# Altium schematic sheet Driver.SchDoc
size 304 x 495 mm; SheetNumber: 1; SheetTotal: 4; SPICEModelCacheATHDNDMS: <root> / <DocumentId>ATHDNDMS</DocumentId> / <CacheFrame Number="0"> / <Model Name="1210_885012009019_2.2nf" Kind="CKT"> / <Text>******* / .subckt 1210_885012009019_2.2nF 1 2 / Rser 1 3 0.0215418747712 / Lser 2 4 2.06777607E-10 / C1 3 4 0.0000000022 / Rpar 3 4 10000000000 / .ends 1210_885012009019_2.2nF</Text> / </Model> / </CacheFrame> / </root>
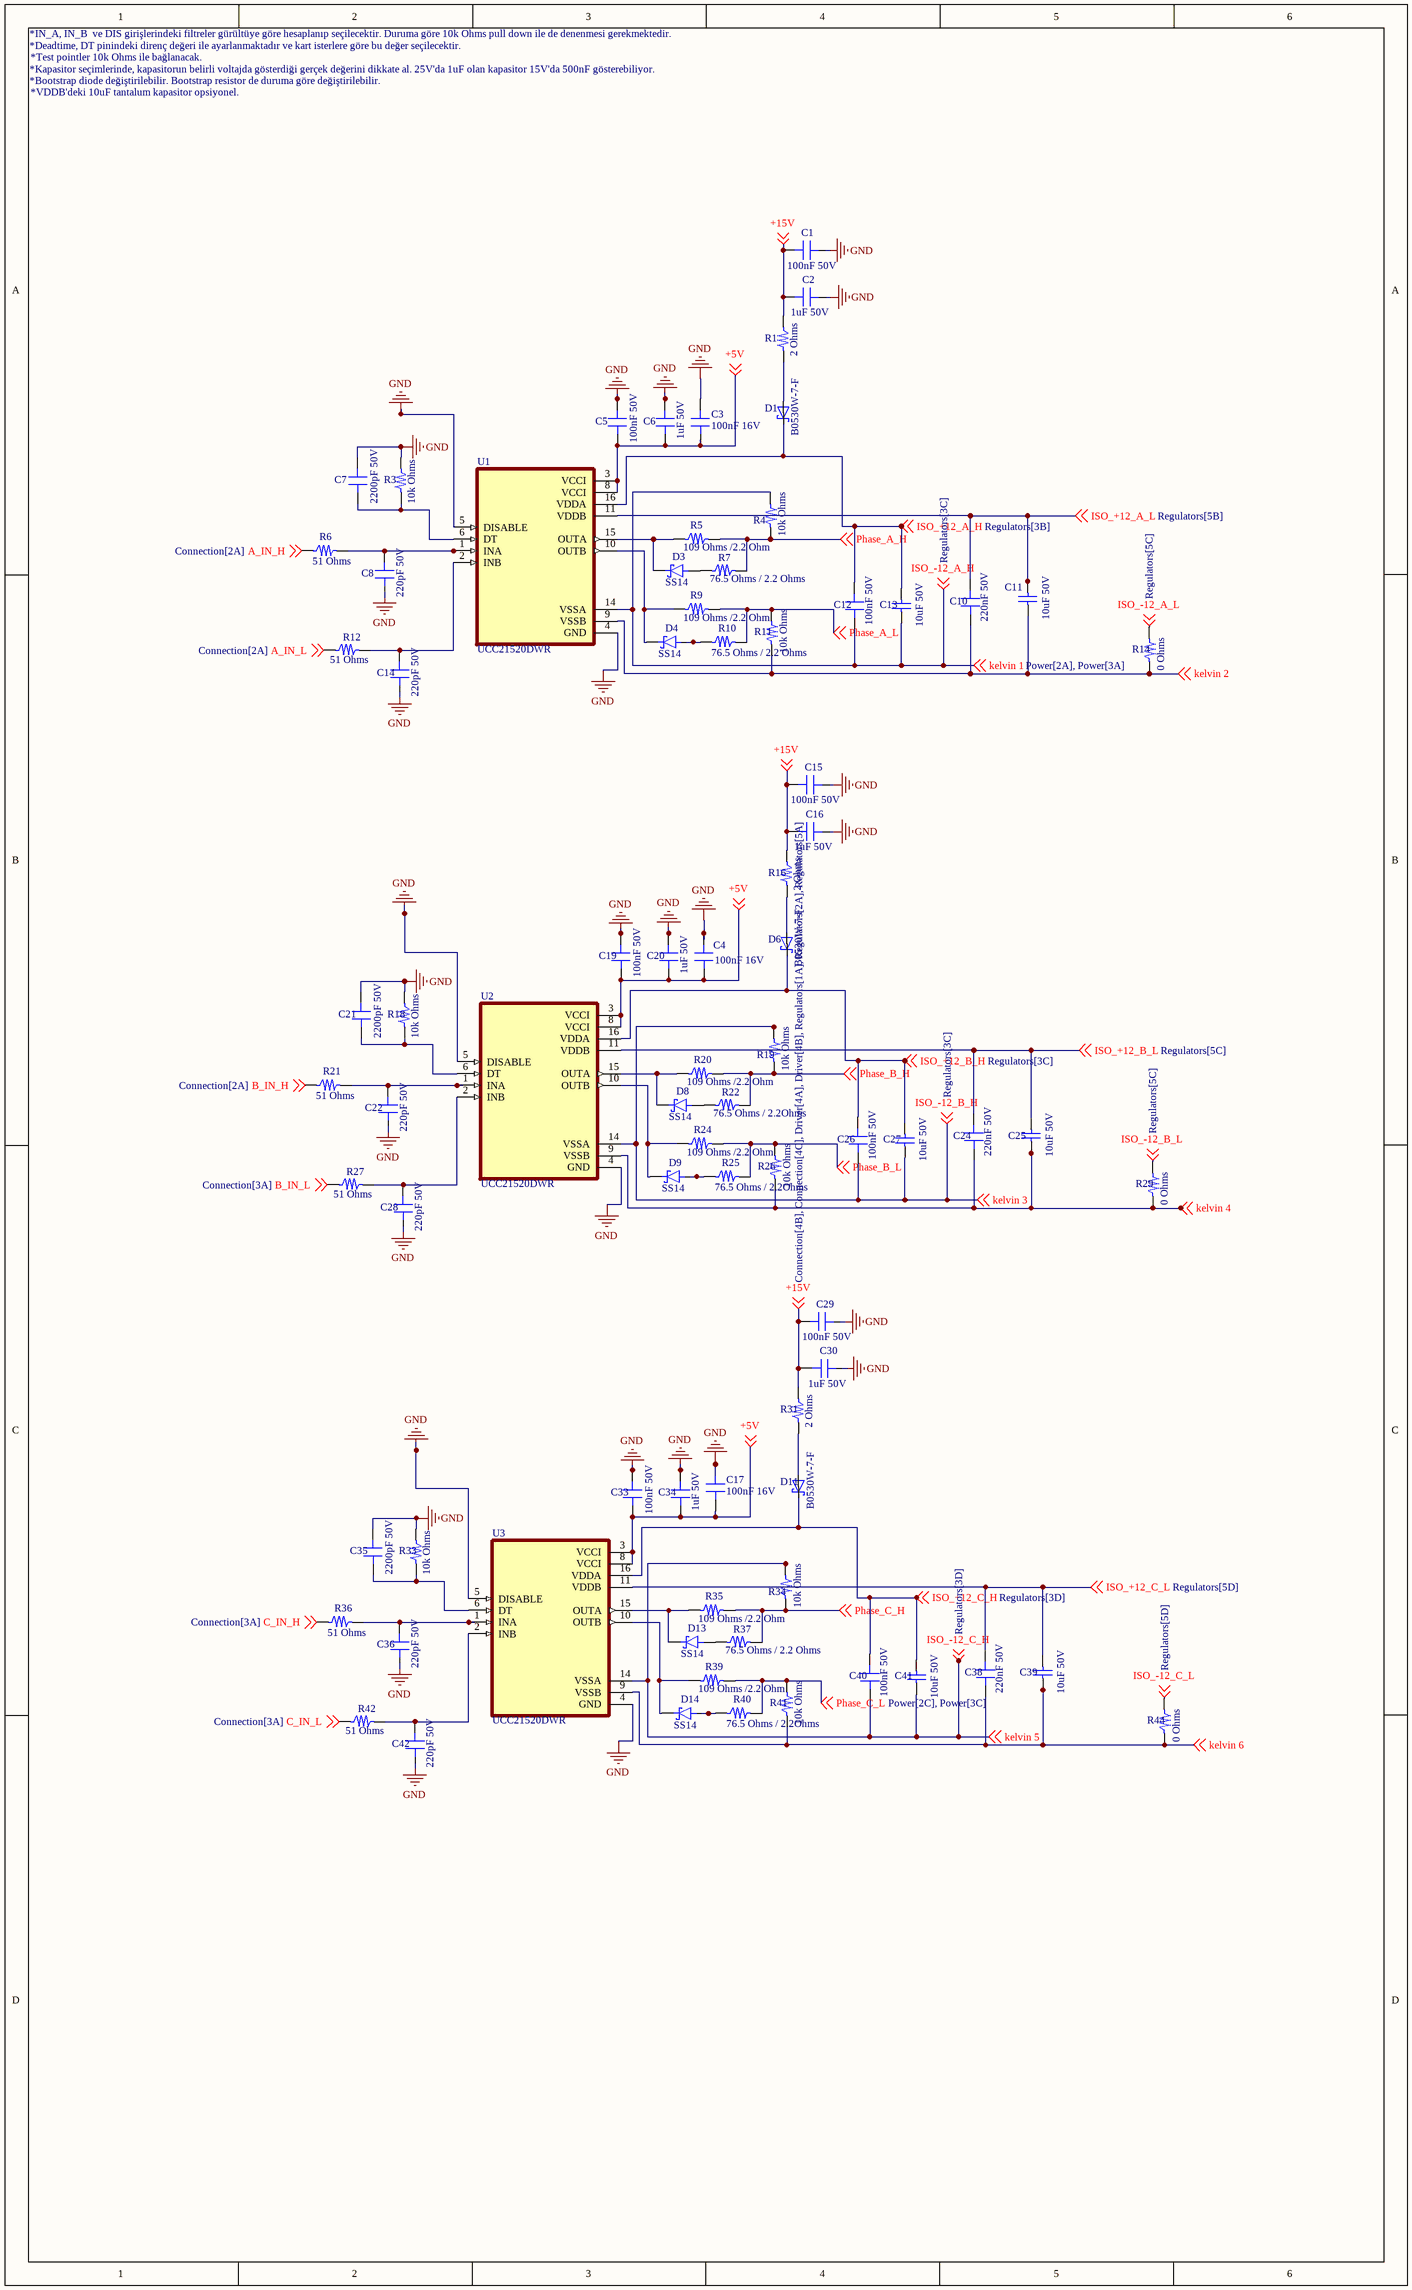
[diagram p0: Driver.SchDoc]

## Parts
C1  100nF 50V  [0805_CAP]
C2  1uF 50V  [0805_CAP]
C3  100nF 16V  [0805_CAP]
C4  100nF 16V  [0805_CAP]
C5  100nF 50V  [0603_CAP]
C6  1uF 50V  [0603_CAP]
C7  2200pF 50V  [0603_CAP]
C8  220pF 50V  [0603_CAP]
C10  220nF 50V  [0805_CAP]
C11  10uF 50V  [WCAP-CSGP_1210_L3.2W2.5H0.95]
C12  100nF 50V  [0805_CAP]
C13  10uF 50V  [WCAP-CSGP_1210_L3.2W2.5H0.95]
C14  220pF 50V  [0603_CAP]
C15  100nF 50V  [0805_CAP]
C16  1uF 50V  [0805_CAP]
C17  100nF 16V  [0805_CAP]
C19  100nF 50V  [0603_CAP]
C20  1uF 50V  [0603_CAP]
C21  2200pF 50V  [0603_CAP]
C22  220pF 50V  [0603_CAP]
C24  220nF 50V  [0805_CAP]
C25  10uF 50V  [WCAP-CSGP_1210_L3.2W2.5H0.95]
C26  100nF 50V  [0805_CAP]
C27  10uF 50V  [WCAP-CSGP_1210_L3.2W2.5H0.95]
C28  220pF 50V  [0603_CAP]
C29  100nF 50V  [0805_CAP]
C30  1uF 50V  [0805_CAP]
C33  100nF 50V  [0603_CAP]
C34  1uF 50V  [0603_CAP]
C35  2200pF 50V  [0603_CAP]
C36  220pF 50V  [0603_CAP]
C38  220nF 50V  [0805_CAP]
C39  10uF 50V  [WCAP-CSGP_1210_L3.2W2.5H0.95]
C40  100nF 50V  [0805_CAP]
C41  10uF 50V  [WCAP-CSGP_1210_L3.2W2.5H0.95]
C42  220pF 50V  [0603_CAP]
D1  B0530W-7-F  [DO-214AC]
D3  SS14  [SOD3715X145N]
D4  SS14  [SOD3715X145N]
D6  B0530W-7-F  [DO-214AC]
D8  SS14  [SOD3715X145N]
D9  SS14  [SOD3715X145N]
D11  B0530W-7-F  [DO-214AC]
D13  SS14  [SOD3715X145N]
D14  SS14  [SOD3715X145N]
R1  2 Ohms  [0805_RES]
R3  10k Ohms  [0603_RES]
R4  10k Ohms  [0805_RES]
R5  109 Ohms /2.2 Ohm  [0805_RES]
R6  51 Ohms  [0603_RES]
R7  76.5 Ohms / 2.2 Ohms  [0805_RES]
R9  109 Ohms /2.2 Ohm  [0805_RES]
R10  76.5 Ohms / 2.2 Ohms  [0805_RES]
R11  10k Ohms  [0805_RES]
R12  51 Ohms  [0603_RES]
R14  0 Ohms  [0805_RES]
R16  2 Ohms  [0805_RES]
R18  10k Ohms  [0603_RES]
R19  10k Ohms  [0805_RES]
R20  109 Ohms /2.2 Ohm  [0805_RES]
R21  51 Ohms  [0603_RES]
R22  76.5 Ohms / 2.2Ohms  [0805_RES]
R24  109 Ohms /2.2 Ohm  [0805_RES]
R25  76.5 Ohms / 2.2Ohms  [0805_RES]
R26  10k Ohms  [0805_RES]
R27  51 Ohms  [0603_RES]
R29  0 Ohms  [0805_RES]
R31  2 Ohms  [0805_RES]
R33  10k Ohms  [0603_RES]
R34  10k Ohms  [0805_RES]
R35  109 Ohms /2.2 Ohm  [0805_RES]
R36  51 Ohms  [0603_RES]
R37  76.5 Ohms / 2.2 Ohms  [0805_RES]
R39  109 Ohms /2.2 Ohm  [0805_RES]
R40  76.5 Ohms / 2.2Ohms  [0805_RES]
R41  10k Ohms  [0805_RES]
R42  51 Ohms  [0603_RES]
R44  0 Ohms  [0805_RES]
U1  UCC21520DWR  [SOIC127P1030X265-16N]
U2  UCC21520DWR  [SOIC127P1030X265-16N]
U3  UCC21520DWR  [SOIC127P1030X265-16N]

## Nets
GND: C1.1 C2.1 C3.1 C4.1 C5.1 C6.1 C7.2 C8.1 C14.1 C15.1 C16.1 C17.1 C19.1 C20.1 C21.2 C22.1 C28.1 C29.1 C30.1 C33.1 C34.1 C35.2 C36.1 C42.1 R3.2 R18.2 R33.2 U1.4(GND) U1.5(DISABLE) U2.4(GND) U2.5(DISABLE) U3.4(GND) U3.5(DISABLE)
+5V: C3.2 C4.2 C5.2 C6.2 C17.2 C19.2 C20.2 C33.2 C34.2 U1.3(VCCI) U1.8(VCCI) U2.3(VCCI) U2.8(VCCI) U3.3(VCCI) U3.8(VCCI) ; off-sheet +5V
+15V: C1.2 C2.2 C15.2 C16.2 C29.2 C30.2 R1.2 R16.2 R31.2 ; off-sheet +15V
A_IN_H: R6.1 ; off-sheet A_IN_H
A_IN_L: R12.1 ; off-sheet A_IN_L
B_IN_H: R21.1 ; off-sheet B_IN_H
B_IN_L: R27.1 ; off-sheet B_IN_L
C_IN_H: R36.1 ; off-sheet C_IN_H
C_IN_L: R42.1 ; off-sheet C_IN_L
ISO_+12_A_H: C12.1 C13.2 D1.K U1.16(VDDA) ; off-sheet ISO_+12_A_H
ISO_+12_A_L: C10.1 C11.2 U1.11(VDDB) ; off-sheet ISO_+12_A_L
ISO_+12_B_H: C26.1 C27.2 D6.K U2.16(VDDA) ; off-sheet ISO_+12_B_H
ISO_+12_B_L: C24.1 C25.2 U2.11(VDDB) ; off-sheet ISO_+12_B_L
ISO_+12_C_H: C40.1 C41.2 D11.K U3.16(VDDA) ; off-sheet ISO_+12_C_H
ISO_+12_C_L: C38.1 C39.2 U3.11(VDDB) ; off-sheet ISO_+12_C_L
ISO_-12_A_H: C12.2 C13.1 R4.1 U1.14(VSSA) ; off-sheet ISO_-12_A_H, off-sheet kelvin 1  [also labelled kelvin 1]
ISO_-12_A_L: R14.1 ; off-sheet ISO_-12_A_L
ISO_-12_B_H: C26.2 C27.1 R19.1 U2.14(VSSA) ; off-sheet ISO_-12_B_H, off-sheet kelvin 3  [also labelled kelvin 3]
ISO_-12_B_L: R29.1 ; off-sheet ISO_-12_B_L
ISO_-12_C_H: C40.2 C41.1 R34.1 U3.14(VSSA) ; off-sheet ISO_-12_C_H, off-sheet kelvin 5  [also labelled kelvin 5]
ISO_-12_C_L: R44.1 ; off-sheet ISO_-12_C_L
kelvin 2: C10.2 C11.1 R11.2 R14.2 U1.9(VSSB) ; off-sheet kelvin 2
kelvin 4: C24.2 C25.1 R26.2 R29.2 U2.9(VSSB) ; off-sheet kelvin 4
kelvin 6: C38.2 C39.1 R41.2 R44.2 U3.9(VSSB) ; off-sheet kelvin 6
Phase_A_H: R4.2 R5.2 R7.2 ; off-sheet Phase_A_H
Phase_A_L: R9.2 R10.2 R11.1 ; off-sheet Phase_A_L
Phase_B_H: R19.2 R20.2 R22.2 ; off-sheet Phase_B_H
Phase_B_L: R24.2 R25.2 R26.1 ; off-sheet Phase_B_L
Phase_C_H: R34.2 R35.2 R37.2 ; off-sheet Phase_C_H
Phase_C_L: R39.2 R40.2 R41.1 ; off-sheet Phase_C_L
NetC7_1: C7.1 R3.1 U1.6(DT)
NetC8_2: C8.2 R6.2 U1.1(INA)
NetC14_2: C14.2 R12.2 U1.2(INB)
NetC21_1: C21.1 R18.1 U2.6(DT)
NetC22_2: C22.2 R21.2 U2.1(INA)
NetC28_2: C28.2 R27.2 U2.2(INB)
NetC35_1: C35.1 R33.1 U3.6(DT)
NetC36_2: C36.2 R36.2 U3.1(INA)
NetC42_2: C42.2 R42.2 U3.2(INB)
NetD1_A: D1.A R1.1
NetD3_A: D3.A R7.1
NetD3_C: D3.C R5.1 U1.15(OUTA)
NetD4_A: D4.A R10.1
NetD4_C: D4.C R9.1 U1.10(OUTB)
NetD6_A: D6.A R16.1
NetD8_A: D8.A R22.1
NetD8_C: D8.C R20.1 U2.15(OUTA)
NetD9_A: D9.A R25.1
NetD9_C: D9.C R24.1 U2.10(OUTB)
NetD11_A: D11.A R31.1
NetD13_A: D13.A R37.1
NetD13_C: D13.C R35.1 U3.15(OUTA)
NetD14_A: D14.A R40.1
NetD14_C: D14.C R39.1 U3.10(OUTB)

## Notes on the sheet
- *IN_A, IN_B  ve DIS girişlerindeki filtreler gürültüye göre hesaplanıp seçilecektir. Duruma göre 10k Ohms pull down ile de denenmesi gerekmektedir.
- *Deadtime, DT pinindeki direnç değeri ile ayarlanmaktadır ve kart isterlere göre bu değer seçilecektir.
- *Kapasitor seçimlerinde, kapasitorun belirli voltajda gösterdiği gerçek değerini dikkate al. 25V'da 1uF olan kapasitor 15V'da 500nF gösterebiliyor.
- *Bootstrap diode değiştirilebilir. Bootstrap resistor de duruma göre değiştirilebilir.
- *Test pointler 10k Ohms ile bağlanacak.
- *VDDB'deki 10uF tantalum kapasitor opsiyonel.

## Library data of the parts
C1 C2 C10 C12 C15 C16 C24 C26 C29 C30 C38 C40 = CAP_0805: Value: 100nF 16V
C3 C4 C17 = CAP_0805: Value: 100nF 16V
C5-C8 C14 C19-C22 C28 C33-C36 C42 = CAP_0603: CL10B105KO8NNNC - MLCC (1608) 0603 1uF 16VDC ±10% X7R; Value: 1uF 16V
C11 C13 C25 C27 C39 C41 = 885012009019: WCAP-CSGP Multilayer Ceramic Chip Capacitor, General Purpose, size 1210, NP0, 2.2nF, 50V; Manufacturer: Wurth Elektronik; Case/Size Code: 1210; Capacitance Tolerance: +/-5%; Insulation Resistance: 10GΩ; Q Factor: 1000; Technical Reference: NP01210222J050DFCT10000; Manufacturer Part Number: 885012009019; Category: Multilayer Ceramic Chip Capacitors; Match Code: WCAP-CSGP; ComponentLink1Description: Website Link; ComponentLink1URL: https://www.we-online.com/redexpert/article/885012009019?ad; ComponentLink2Description: Datasheet Link; ComponentLink2URL: https://www.we-online.com/redexpert/spec/885012009019?ad; Mount: Surface Mount; Min Operating Temperature: -55°C; Max Operating Temperature: 125°C; Packaging: Tape and Reel; Length: 3.2mm; Width: 2.5mm; Height: 0.95mm; Capacitance: 2.2nF; Ceramic Type: NP0; Rated Voltage (DC): 50V
D1 D6 D11 = SS14: Diode Schottky 40 V 1A Surface Mount DO-214AC (SMA); MF: ON Semiconductor; SnapEDA_Link: https://www.snapeda.com/parts/SS14/Onsemi/view-part/?ref=snap; Package: SMA-2 ON Semiconductor; Value: *; MP: SS14; Check_prices: https://www.snapeda.com/parts/SS14/Onsemi/view-part/?ref=eda
D3 D4 D8 D9 D13 D14 = B0530W-7-F: Diode Schottky 30V 500mA Surface Mount SOD-123; MF: Diodes Inc.; MP: B0530W-7-F; Availability: Unavailable; SnapEDA_Link: https://www.snapeda.com/parts/B0530W-7-F/Diodes%20Inc./view-part/272168/?ref=snap; Package: SOD-123 Diodes Inc.; Value: *; Price: None
R1 R4 R5 R7 R9-R11 R14 R16 R19 R20 R22 R24-R26 R29 R31 R34 R35 R37 R39-R41 R44 = RES_0805: 0805; Value: 1k Ohms; Power: 1/8 W
R3 R6 R12 R18 R21 R27 R33 R36 R42 = 1k Ohms
U1-U3 = UCC21520DWR: 5.7kVrms, 4A/6A dual-channel isolated gate driver w/ dual input, disable pin, 8V UVLO in DW package; MF: Texas Instruments; Check_prices: https://www.snapeda.com/parts/UCC21520DWR/Texas+Instruments/view-part/?ref=eda; Package: SOIC-16 Texas Instruments; Value: *; MP: UCC21520DWR; Price: None; Availability: In Stock; SnapEDA_Link: https://www.snapeda.com/parts/UCC21520DWR/Texas+Instruments/view-part/?ref=snap; Purchase-URL: https://pricing.snapeda.com/search/part/UCC21520DWR/?ref=eda